# EAGLE design IoT Button with NeoPixel BFF (EAGLE 9.6.2)
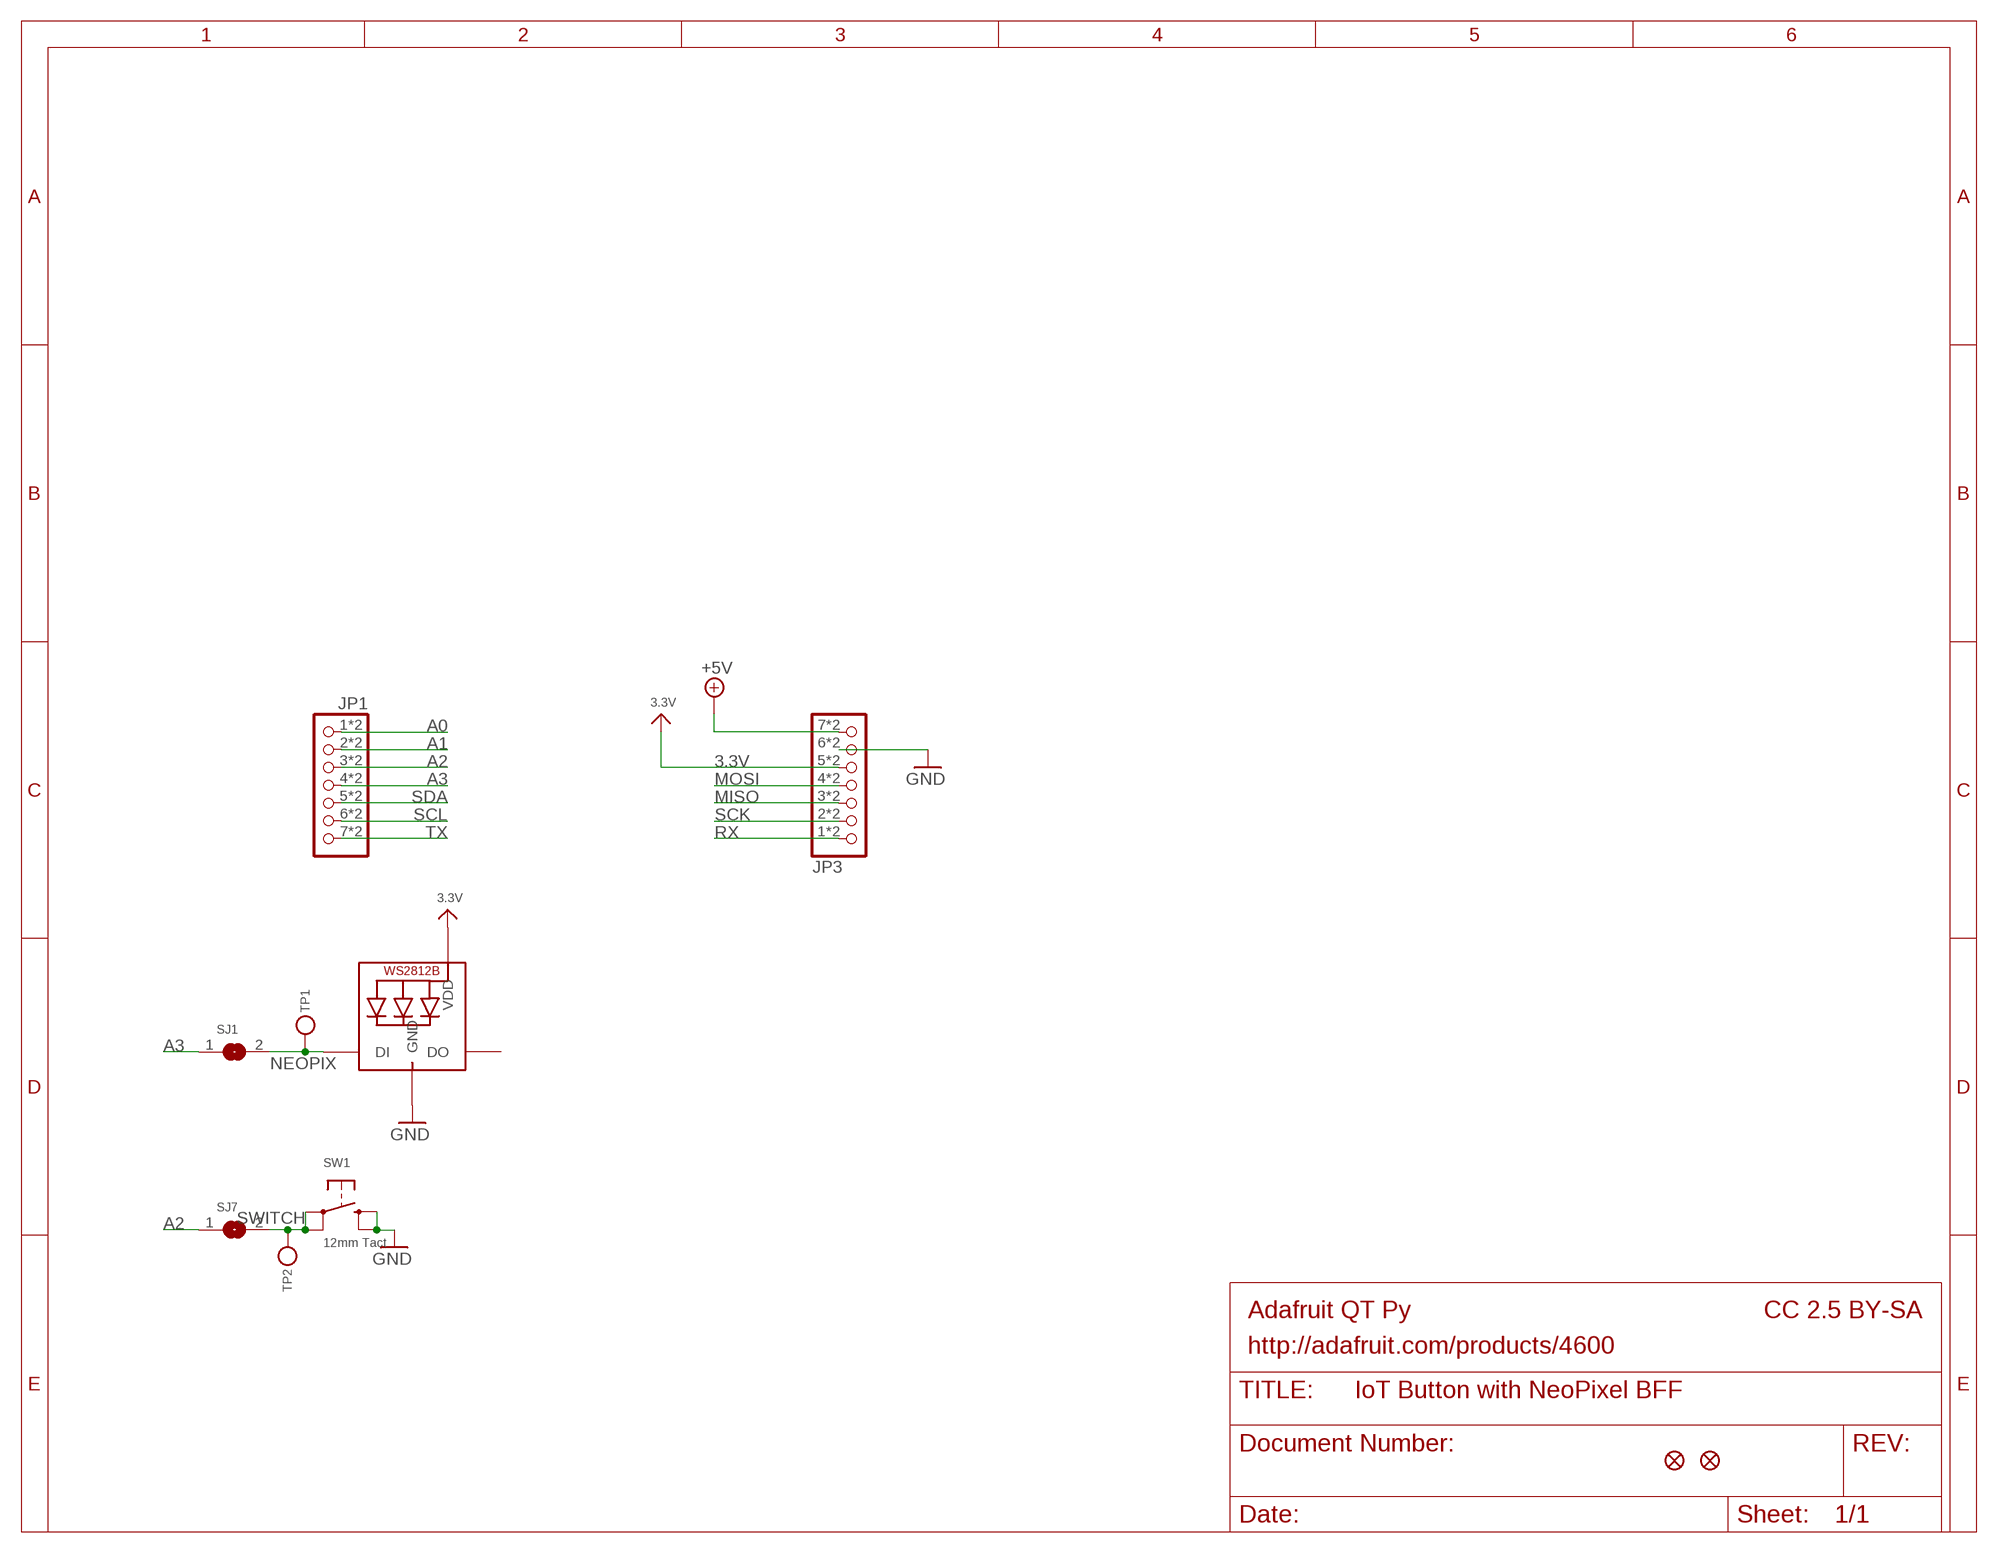
[diagram p0: schematic, sheet 1]

## Parts
JP1  HEADER-1X7_CASTEL  [1X07_CASTEL]
JP3  HEADER-1X7_CASTEL  [1X07_CASTEL]
LED1  WS2812B_3535FULL  [LED3535_FULLPADS]
SJ1  SOLDERJUMPERCLOSED  [SOLDERJUMPER_CLOSEDWIRE]
SJ7  SOLDERJUMPERCLOSED  [SOLDERJUMPER_CLOSEDWIRE]
SW1  12mm Tact  SWITCH_TACT_SMT_12MM  [B3F-40XX-SMT]
TP1  TESTPOINT1.5X2.0MM_NOCREAM  [PAD-1.5X2.0]
TP2  TESTPOINT1.5X2.0MM_NOCREAM  [PAD-1.5X2.0]
U$6  FIDUCIAL_1MM  [FIDUCIAL_1MM]
U$8  FIDUCIAL_1MM  [FIDUCIAL_1MM]

## Nets
3.3V: JP3.5 JP3.5C LED1.2(VDD)
+5V [power]: JP3.7 JP3.7C
A0: JP1.1 JP1.1C
A1: JP1.2 JP1.2C
A2: JP1.3 JP1.3C SJ7.1
A3: JP1.4 JP1.4C SJ1.1
GND [power]: JP3.6 JP3.6C LED1.4(GND) SW1.P$3(S) SW1.P$4(S1)
MISO: JP3.3 JP3.3C
MOSI: JP3.4 JP3.4C
NEOPIX: LED1.1(DI) SJ1.2 TP1.P$1
RX: JP3.1 JP3.1C
SCK: JP3.2 JP3.2C
SCL: JP1.6 JP1.6C
SDA: JP1.5 JP1.5C
SWITCH: SJ7.2 SW1.P$1(P) SW1.P$2(P1) TP2.P$1
TX: JP1.7 JP1.7C
Unconnected: LED1.3(DO)

## Notes on the sheet
- Adafruit QT Py | CC 2.5 BY-SA
- http://adafruit.com/products/4600

## Library data of the parts
JP1 JP3 = adafruit_electromech:HEADER-1X7: PIN HEADER
LED1 = microbuilder:WS2812B
SJ1 SJ7 = microbuilder:SOLDERJUMPER: SMD Solder JUMPER Solder the two pads together to create a connection, or remove the solder to break it. REFLOW - Use this footprint for solder paste and reflow ovens. WAVE - Use this footprint for hand-soldering (larger pads). CLOSED - Has a trace between the two pads to ensure it is closed by default. The trace needs to be cut to disable the jumper, and can be closed again by creating a solder bridge between the two pads.
SW1 = adafruit_electromech:SWITCH_TACT_SMT: SMT Tact Switches 6x6mm - Digikey: P12940SCT-ND KMR2 (4.6x2.8mm) - Digikey: 401-1426-1-ND EVQ-PQHB55 - Light Touch, 160GF (4.5x4.5mm) - Digikey: P8090SCT-ND KMT0 - KMT021 NGJ LHS (etc.) IP68/Waterproof - Digikey: CKN10289CT-ND
TP1 TP2 = microbuilder:TESTPOINT: Test Point Various test points for characterisation and PCB testing TESTPOINT_SMT - Compact Surface Mount Test Point [Digikey: 5016KTR-ND]
U$6 U$8 = microbuilder:FIDUCIAL: Fiducial Alignment Points Various fiducial points for machine vision alignment.; BOM: EXCLUDE

## Net classes
1 power: width 0.305 mm
2 thickpower: width 0.406 mm

## Board
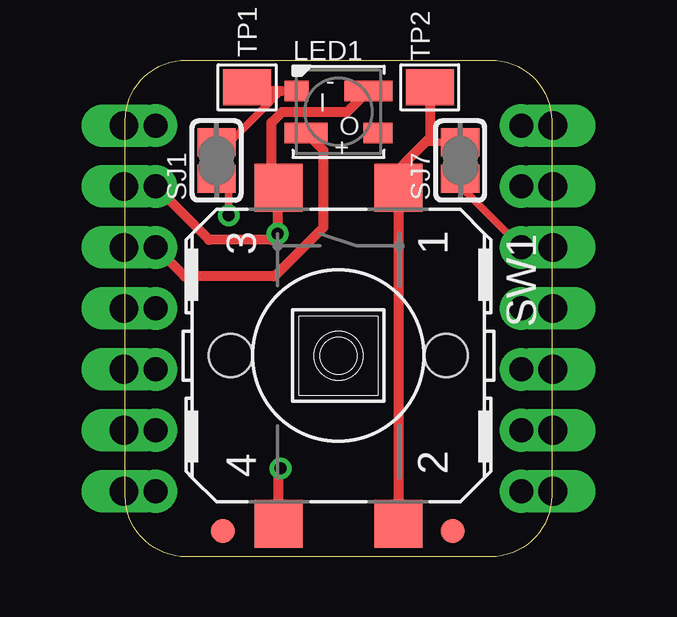
[diagram p1: board, top side]
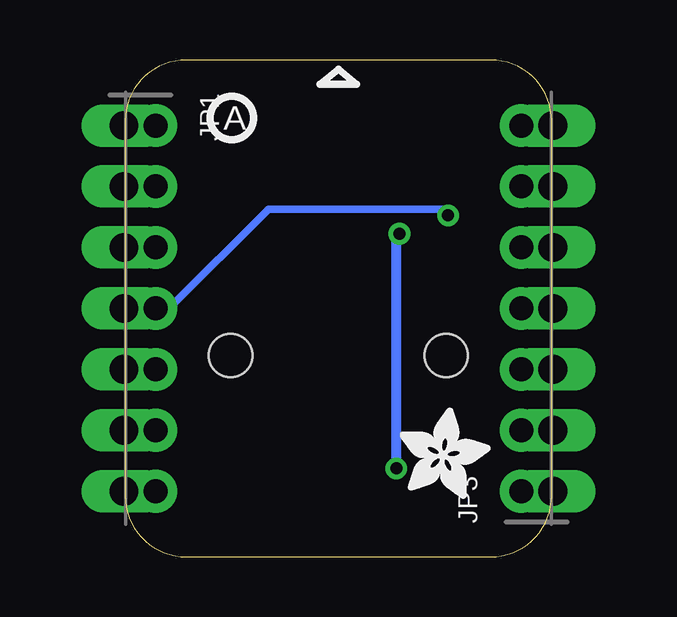
[diagram p2: board, bottom side, seen from below]

Size 17.78 x 20.7 mm. Coordinates in mm from the lower left corner, seen from the top.
Outline: 17.78,18.16 17.78,2.54 arc-90 15.24,0 2.54,0 arc-90 0,2.54 0,18.16 arc-90 2.54,20.7 15.24,20.7 arc-90 17.78,18.16
Copper layers (1*16): Top 0.035mm / dielectric 1.5mm / Bottom 0.035mm
Design rules "adafruit 7-7": minimum track width 7mil, minimum drill 15.5mil, track to track 7mil, track to pad 7mil, pad to pad 7mil, via to via 7mil, smd to smd 7mil, copper to edge 10mil, drill to drill 8mil, minimum pad ring 7mil, minimum via ring 8mil, stop-mask expansion 2mil, vias tented up to drill 20mil, thermal gap 10mil

### Footprints (pad centres in the part's own frame; a part is rotated, then mirrored left to right if it is on the bottom)
1X07_CASTEL = drill 1 pad 1.778: 1 -7.62,0; 2 -5.08,0; 3 -2.54,0; 4 0,0; 5 2.54,0; 6 5.08,0; 7 7.62,0 | drill 1.2 pad 1.778 long: 1C -7.62,-1.324; 2C -5.08,-1.324; 3C -2.54,-1.324; 4C 0,-1.324; 5C 2.54,-1.324; 6C 5.08,-1.324; 7C 7.62,-1.324
LED3535_FULLPADS = smd 1 x 0.85: 1 -1.75,0.875 | smd 1.8 x 0.85: 2 -1.35,-0.875 | smd 1.2 x 0.85: 3 1.65,-0.875 | smd 2 x 0.85: 4 1.25,0.875
SOLDERJUMPER_CLOSEDWIRE = smd 1.168 x 1.6: 1 -0.762,0; 2 0.762,0 | smd 0.635 x 0.203: WIRE 0,0
B3F-40XX-SMT = smd 2 x 2: P$1 -7,2.5; P$2 7,2.5; P$3 -7,-2.5; P$4 7,-2.5 | hole 1.803: 0,-4.496; 0,4.496
PAD-1.5X2.0 = smd 1.5 x 2: P$1 0,0
FIDUCIAL_1MM = smd 1 x 1: 1 0,0

### Placement (x,y rotation side)
JP1  16.51,10.35 270 bottom
JP3  1.27,10.35 90 bottom
LED1  8.89,18.54 0 top
PLABEL1  [PLABEL1]  15.62,1.14 0 top
PLABEL3  [PLABEL3]  1.97,19.68 0 top
PLABEL6  [PLABEL6]  15.75,19.56 0 top
PLABEL14  [PLABEL14]  2.1,1.14 0 top
SJ1  3.81,16.51 90 top
SJ7  13.97,16.51 90 top
SW1  8.89,8.38 270 top
TP1  5.08,19.56 90 top
TP2  12.7,19.56 90 top
U$2  [ADAFRUIT_3.5MM]  6.35,2.41 0 bottom
U$3  [PCBFEAT-REV-040]  13.34,18.29 0 bottom
U$6  4.08,1.08 0 top
U$8  13.65,1.08 0 top

### Tracks (layer width: path | path; a pad name or v marks a point on that pad's centre or on a via)
3.3V
  Top 0.305: JP3.5C JP3.5
  Top 0.406: LED1.2 8.26,16.95 8.26,13.72 6.22,11.68 2.48,11.68 JP3.5
+5V
  Top 0.305: JP3.7C JP3.7
A0
  Bottom 0.406: JP1.1C JP1.1
A1
  Bottom 0.406: JP1.2C JP1.2
A2
  Top 0.305: JP1.3 13.84,15.56 SJ7.1
  Bottom 0.406: JP1.3C JP1.3
A3  (via drill 0.5)
  Top 0.305: JP1.4C JP1.4 | SJ1.1 4.32,15.49 v4.32,14.22
  Bottom 0.305: JP1.4C 15.94,10.35 11.81,14.48 4.57,14.48 v4.32,14.22
GND  (via drill 0.5)
  Top 0.305: JP3.6C JP3.6
  Top 0.406: JP3.6 3.49,13.21 6.1,13.21 v6.35,13.46 6.35,15.09 6.39,15.13 SW1.P$3 6.1,15.68 6.1,18.09 6.55,18.54 9.27,18.54 LED1.4 | SW1.P$4 6.39,3.6 v6.48,3.68
  Bottom 0.406: v6.48,3.68 6.48,13.34 v6.35,13.46
MISO
  Top 0.254: JP3.3C JP3.3
MOSI
  Top 0.254: JP3.4C JP3.4
NEOPIX
  Top 0.305: SJ1.2 4.36,17.27 6.5,19.42 LED1.1
  Top 0.406: TP1.P$1 5.22,19.42 6.5,19.42
RX
  Top 0.254: JP3.1C JP3.1
SCK
  Top 0.254: JP3.2C JP3.2
SCL
  Bottom 0.406: JP1.6C JP1.6
SDA
  Bottom 0.406: JP1.5C JP1.5
SWITCH
  Top 0.305: SJ7.2 12.52,17.27 11.59,16.35 11.39,16.14 SW1.P$1
  Top 0.406: SW1.P$1 SW1.P$2 | TP2.P$1 12.7,17.45 11.59,16.35
TX
  Bottom 0.406: JP1.7C JP1.7

### Text on the board
Pinguin_tBackup: 5V | A0 | A1 | G | 3V | S | A2 | - | A3 | MO | + | MI | SDA | SCK | SCL | RX | Sig | TX | NeoPixel BFF
Pinguin_bBackup: USB | NeoPixel Driver / Neo+ <-> 5V / QT Py. Solder / back to back / Signal on A3